# EAGLE design PushButtonAction_4017 (EAGLE 9.5.2)

## Sheet 1 of 2
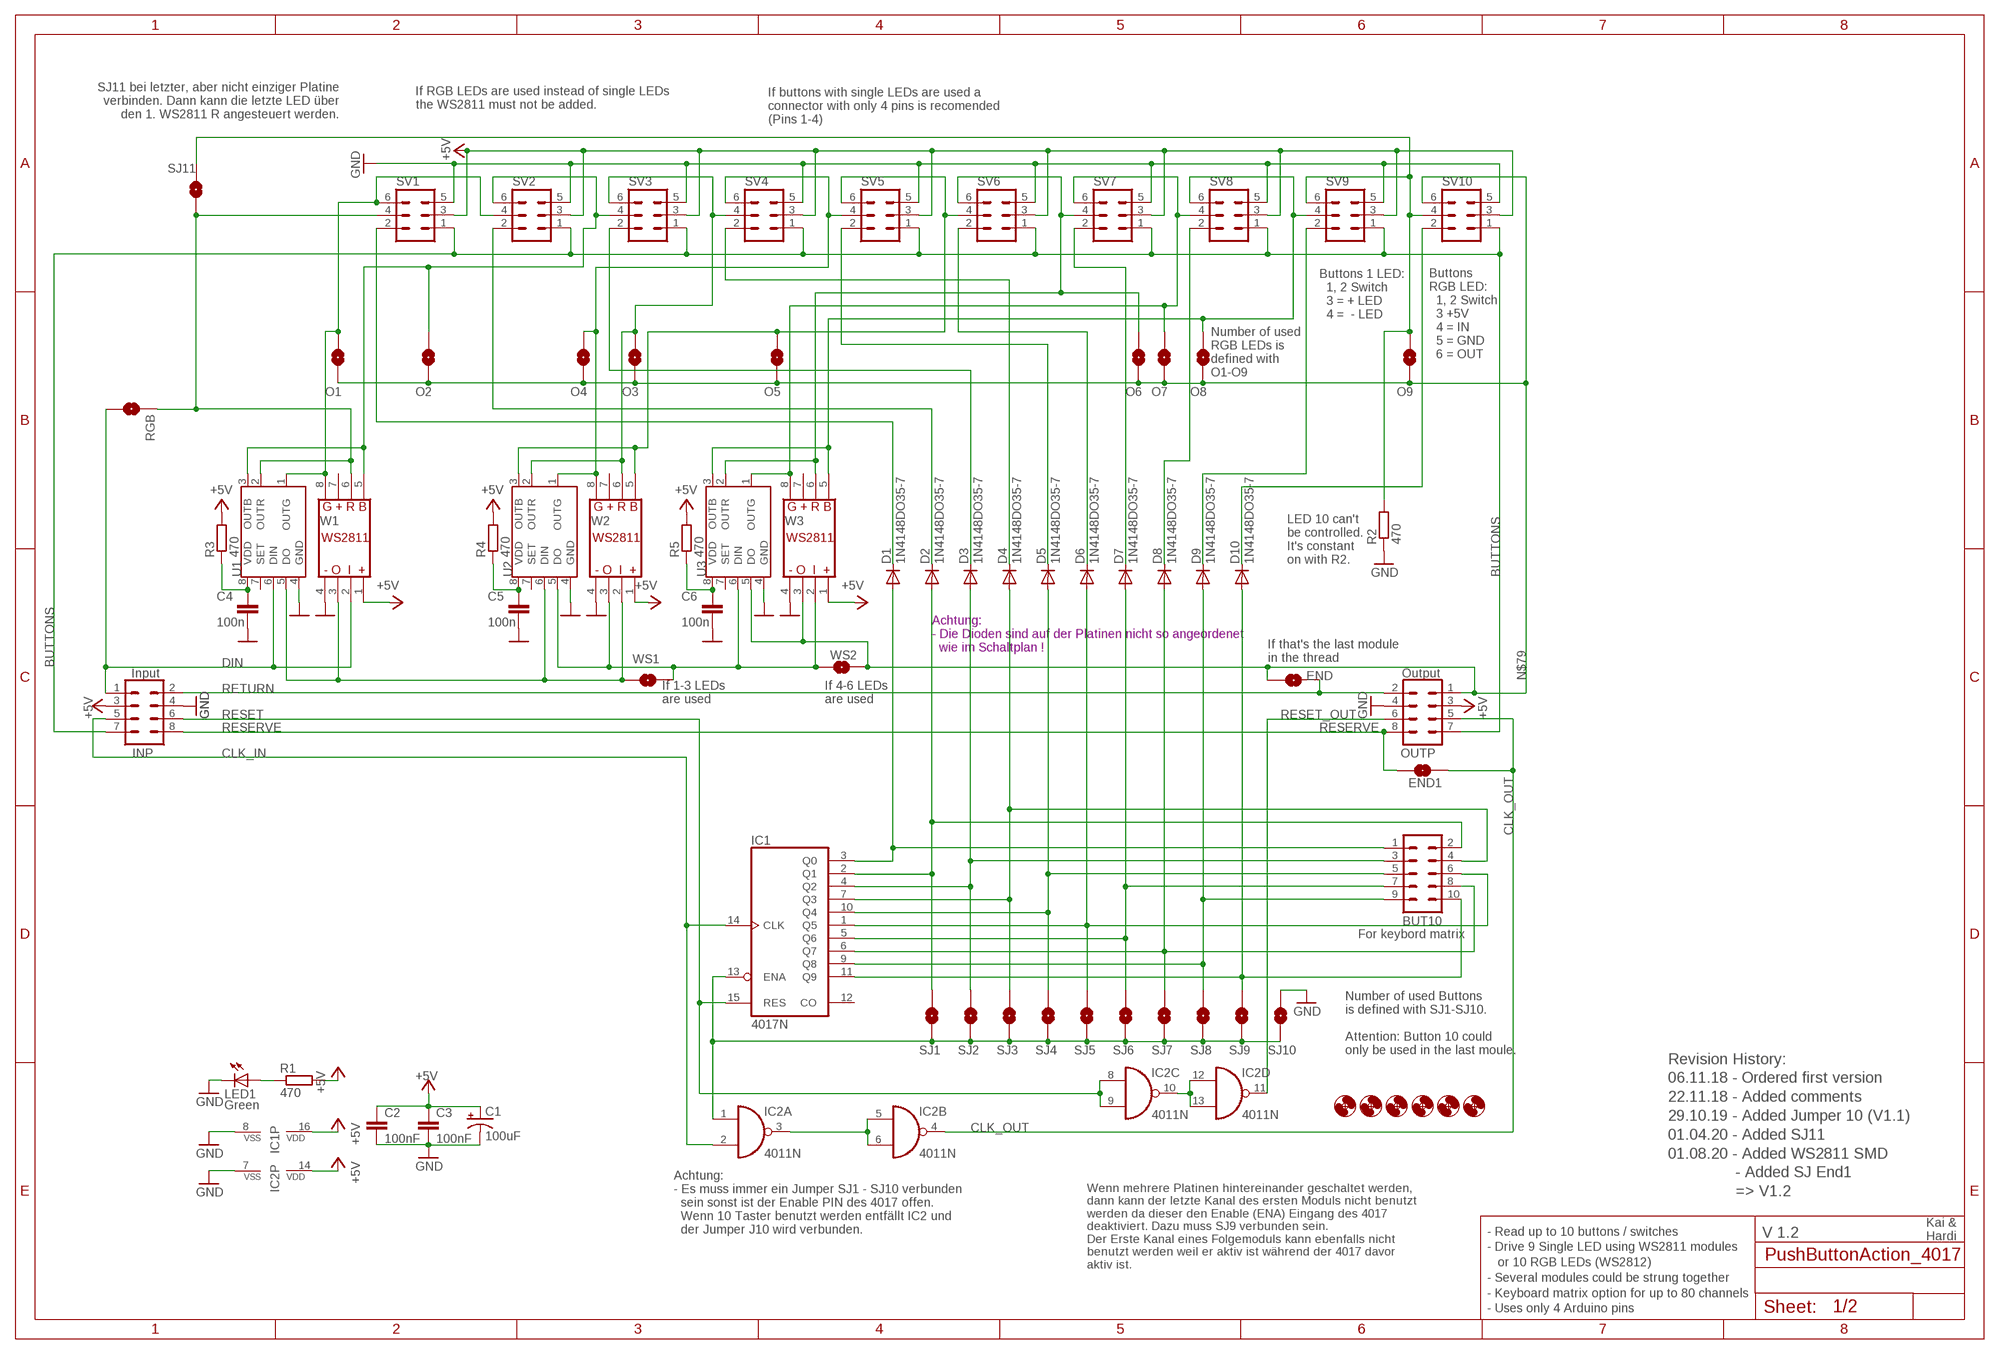
[diagram p0: schematic, sheet 1]

### Parts
BUT10  CON-HARTING-ML_ML10  [CON-HARTING-ML_ML10]
C1  100uF  100UF-25V-20%(PTH)  [CPOL-RADIAL-100UF-25V]
C2  100nF  0.1UF-50V-20%(PTH)KIT-EZ  [CAP-PTH-SMALL-KIT]
C3  100nF  0.1UF-50V-20%(PTH)KIT-EZ  [CAP-PTH-SMALL-KIT]
C4  100n  C-EU025-024X044  [C025-024X044]
C5  100n  C-EU025-024X044  [C025-024X044]
C6  100n  C-EU025-024X044  [C025-024X044]
D1  1N4148DO35-7  [DO35-7]
D2  1N4148DO35-7  [DO35-7]
D3  1N4148DO35-7  [DO35-7]
D4  1N4148DO35-7  [DO35-7]
D5  1N4148DO35-7  [DO35-7]
D6  1N4148DO35-7  [DO35-7]
D7  1N4148DO35-7  [DO35-7]
D8  1N4148DO35-7  [DO35-7]
D9  1N4148DO35-7  [DO35-7]
D10  1N4148DO35-7  [DO35-7]
END  SOLDERJUMPERNO  [SJ_2S-NO]
END1  SOLDERJUMPERNO  [SJ_2S-NO]
H1  MOUNT-HOLE3.0  [3,0]
H2  MOUNT-HOLE3.0  [3,0]
H3  MOUNT-HOLE3.0  [3,0]
H4  MOUNT-HOLE3.0  [3,0]
H5  MOUNT-HOLE3.0  [3,0]
H6  MOUNT-HOLE3.0  [3,0]
IC1  4017N  [DIL16]
IC2  4011N  [DIL14]
INP  CON-HARTING-ML_ML08  [CON-HARTING-ML_ML08]
LED1  Green  LED3MM  [LED3MM]
O1  SOLDERJUMPERNO  [SJ_2S-NO]
O2  SOLDERJUMPERNO  [SJ_2S-NO]
O3  SOLDERJUMPERNO  [SJ_2S-NO]
O4  SOLDERJUMPERNO  [SJ_2S-NO]
O5  SOLDERJUMPERNO  [SJ_2S-NO]
O6  SOLDERJUMPERNO  [SJ_2S-NO]
O7  SOLDERJUMPERNO  [SJ_2S-NO]
O8  SOLDERJUMPERNO  [SJ_2S-NO]
O9  SOLDERJUMPERNO  [SJ_2S-NO]
OUTP  CON-HARTING-ML_ML08  [CON-HARTING-ML_ML08]
R1  470  R-EU_0207/2V  [0207/2V]
R2  470  R-EU_0204/5  [0204/5]
R3  470  R-EU_0207/2V  [0207/2V]
R4  470  R-EU_0207/2V  [0207/2V]
R5  470  R-EU_0207/2V  [0207/2V]
RGB  SOLDERJUMPERNO  [SJ_2S-NO]
SJ1  SOLDERJUMPERNO  [SJ_2S-NO]
SJ2  SOLDERJUMPERNO  [SJ_2S-NO]
SJ3  SOLDERJUMPERNO  [SJ_2S-NO]
SJ4  SOLDERJUMPERNO  [SJ_2S-NO]
SJ5  SOLDERJUMPERNO  [SJ_2S-NO]
SJ6  SOLDERJUMPERNO  [SJ_2S-NO]
SJ7  SOLDERJUMPERNO  [SJ_2S-NO]
SJ8  SOLDERJUMPERNO  [SJ_2S-NO]
SJ9  SOLDERJUMPERNO  [SJ_2S-NO]
SJ10  SOLDERJUMPERNO  [SJ_2S-NO]
SJ11  SOLDERJUMPERNO  [SJ_2S-NO]
SV1  CON-HARTING-ML_ML6  [CON-HARTING-ML_ML6]
SV2  CON-HARTING-ML_ML6  [CON-HARTING-ML_ML6]
SV3  CON-HARTING-ML_ML6  [CON-HARTING-ML_ML6]
SV4  CON-HARTING-ML_ML6  [CON-HARTING-ML_ML6]
SV5  CON-HARTING-ML_ML6  [CON-HARTING-ML_ML6]
SV6  CON-HARTING-ML_ML6  [CON-HARTING-ML_ML6]
SV7  CON-HARTING-ML_ML6  [CON-HARTING-ML_ML6]
SV8  CON-HARTING-ML_ML6  [CON-HARTING-ML_ML6]
SV9  CON-HARTING-ML_ML6  [CON-HARTING-ML_ML6]
SV10  CON-HARTING-ML_ML6  [CON-HARTING-ML_ML6]
U1  S3PO_MODUL_WS2811_SOUND_MP3-TF-16P_WS2811_AND_ATTINY_WS2811-ICSOP8  [SOP8]
U2  S3PO_MODUL_WS2811_SOUND_MP3-TF-16P_WS2811_AND_ATTINY_WS2811-ICSOP8  [SOP8]
U3  S3PO_MODUL_WS2811_SOUND_MP3-TF-16P_WS2811_AND_ATTINY_WS2811-ICSOP8  [SOP8]
W1  WS28115V  [WS2811_WS2811_5V]
W2  WS28115V  [WS2811_WS2811_5V]
W3  WS28115V  [WS2811_WS2811_5V]
WS1  SOLDERJUMPERNO  [SJ_2S-NO]
WS2  SOLDERJUMPERNO  [SJ_2S-NO]

### Nets
+5V: C1.1(+) C2.1 C3.1 IC1.16(VDD) IC2.14(P:VDD) INP.3 OUTP.3 R1.2 R3.2 R4.2 R5.2 SV1.3 SV2.3 SV3.3 SV4.3 SV5.3 SV6.3 SV7.3 SV8.3 SV9.3 SV10.3 W1.1 W2.1 W3.1
BUTTONS: INP.7 OUTP.7 SV1.1 SV2.1 SV3.1 SV4.1 SV5.1 SV6.1 SV7.1 SV8.1 SV9.1 SV10.1
CLK_IN: IC1.14(CLK) IC2.2(A:I1) INP.5
CLK_OUT: END1.1 IC2.4(B:O) OUTP.5
DIN: INP.1 RGB.1 U1.6(DIN) W1.2
GND: C1.2(-) C2.2 C3.2 C4.2 C5.2 C6.2 IC1.8(VSS) IC2.7(P:VSS) INP.4 LED1.K(C) OUTP.4 R2.1 SJ10.2 SV1.5 SV2.5 SV3.5 SV4.5 SV5.5 SV6.5 SV7.5 SV8.5 SV9.5 SV10.5 U1.4(GND) U2.4(GND) U3.4(GND) W1.4 W2.4 W3.4
N$1: IC2.3(A:O) IC2.5(B:I0) IC2.6(B:I1)
N$2: IC1.13(ENA) IC2.1(A:I0) SJ1.1 SJ2.1 SJ3.1 SJ4.1 SJ5.1 SJ6.1 SJ7.1 SJ8.1 SJ9.1 SJ10.1
N$3: IC2.10(C:O) IC2.12(D:I0) IC2.13(D:I1)
N$4: RGB.2 SJ11.2 SV1.4 U1.2(OUTR) W1.6
N$5: BUT10.10 D10.A IC1.11(Q9) SJ9.2
N$6: D1.C SV1.2
N$7: U1.5(DO) U2.6(DIN) W1.3 W2.2 WS1.1
N$8: O5.2 SV5.6 SV6.4 U2.3(OUTB) W2.5
N$9: D2.C SV2.2
N$10: D3.C SV3.2
N$11: BUT10.2 D2.A IC1.2(Q1) SJ1.2
N$12: BUT10.3 D3.A IC1.4(Q2) SJ2.2
N$13: BUT10.4 D4.A IC1.7(Q3) SJ3.2
N$14: BUT10.5 D5.A IC1.10(Q4) SJ4.2
N$15: BUT10.6 D6.A IC1.1(Q5) SJ5.2
N$16: BUT10.7 D7.A IC1.5(Q6) SJ6.2
N$17: BUT10.8 D8.A IC1.6(Q7) SJ7.2
N$18: BUT10.9 D9.A IC1.9(Q8) SJ8.2
N$19: D4.C SV4.2
N$20: D5.C SV5.2
N$21: LED1.A R1.1
N$22: U2.5(DO) U3.6(DIN) W2.3 W3.2 WS1.2 WS2.2
N$23: D6.C SV6.2
N$25: D8.C SV8.2
N$26: D9.C SV9.2
N$27: D10.C SV10.2
N$35: BUT10.1 D1.A IC1.3(Q0)
N$45: O1.2 SV1.6 SV2.4 U1.1(OUTG) W1.8
N$46: O2.2 SV2.6 SV3.4 U1.3(OUTB) W1.5
N$49: O4.2 SV4.6 SV5.4 U2.1(OUTG) W2.8
N$51: O3.2 SV3.6 SV4.4 U2.2(OUTR) W2.6
N$54: O6.2 SV6.6 SV7.4 U3.2(OUTR) W3.6
N$56: O7.2 SV7.6 SV8.4 U3.1(OUTG) W3.8
N$57: O8.2 SV8.6 SV9.4 U3.3(OUTB) W3.5
N$58: O9.2 R2.2 SJ11.1 SV9.6 SV10.4
N$76: C4.1 R3.1 U1.8(VDD)
N$77: C5.1 R4.1 U2.8(VDD)
N$78: C6.1 R5.1 U3.8(VDD)
N$79: END.2 O1.1 O2.1 O3.1 O4.1 O5.1 O6.1 O7.1 O8.1 O9.1 OUTP.1 SV10.6 U3.5(DO) W3.3 WS2.1
O6: D7.C SV7.2
RESERVE: END1.2 INP.8 OUTP.8
RESET: IC1.15(RES) IC2.8(C:I0) IC2.9(C:I1) INP.6
RESET_OUT: IC2.11(D:O) OUTP.6
RETURN: END.1 INP.2 OUTP.2
Unconnected: IC1.12(CO) U1.7(SET) U2.7(SET) U3.7(SET) W1.7 W2.7 W3.7

### Notes on the sheet
- SJ11 bei letzter, aber nicht einziger Platine
  verbinden. Dann kann die letzte LED über
  den 1. WS2811 R angesteuert werden.
- If RGB LEDs are used instead of single LEDs
  the WS2811 must not be added.
- If buttons with single LEDs are used a 
  connector with only 4 pins is recomended
  (Pins 1-4)
- Buttons 1 LED:
    1, 2 Switch
    3 = + LED
    4 =  - LED
- Buttons
  RGB LED:
    1, 2 Switch
    3 +5V
    4 = IN
    5 = GND
    6 = OUT
- Number of used
  RGB LEDs is 
  defined with 
  O1-O9
- LED 10 can't
  be controlled.
  It's constant
  on with R2.
- Achtung:
  - Die Dioden sind auf der Platinen nicht so angeordenet
    wie im Schaltplan !
- If that's the last module 
  in the thread
- Input | Output
- If 1-3 LEDs
  are used
- If 4-6 LEDs
  are used
- For keybord matrix
- Number of used Buttons
  is defined with SJ1-SJ10.
  
  Attention: Button 10 could
  only be used in the last moule.
- Achtung:
  - Es muss immer ein Jumper SJ1 - SJ10 verbunden
    sein sonst ist der Enable PIN des 4017 offen.
    Wenn 10 Taster benutzt werden entfällt IC2 und 
    der Jumper J10 wird verbunden.
- Wenn mehrere Platinen hintereinander geschaltet werden,
  dann kann der letzte Kanal des ersten Moduls nicht benutzt
  werden da dieser den Enable (ENA) Eingang des 4017
  deaktiviert. Dazu muss SJ9 verbunden sein.
  Der Erste Kanal eines Folgemoduls kann ebenfalls nicht
  benutzt werden weil er aktiv ist während der 4017 davor
  aktiv ist.
- Revision History:
  06.11.18 - Ordered first version
  22.11.18 - Added comments
  29.10.19 - Added Jumper 10 (V1.1)
  01.04.20 - Added SJ11
  01.08.20 - Added WS2811 SMD
                 - Added SJ End1
                 => V1.2
- V 1.2
- Kai & 
  Hardi
- - Read up to 10 buttons / switches
  - Drive 9 Single LED using WS2811 modules
     or 10 RGB LEDs (WS2812)
  - Several modules could be strung together
  - Keyboard matrix option for up to 80 channels
  - Uses only 4 Arduino pins

## Sheet 2 of 2
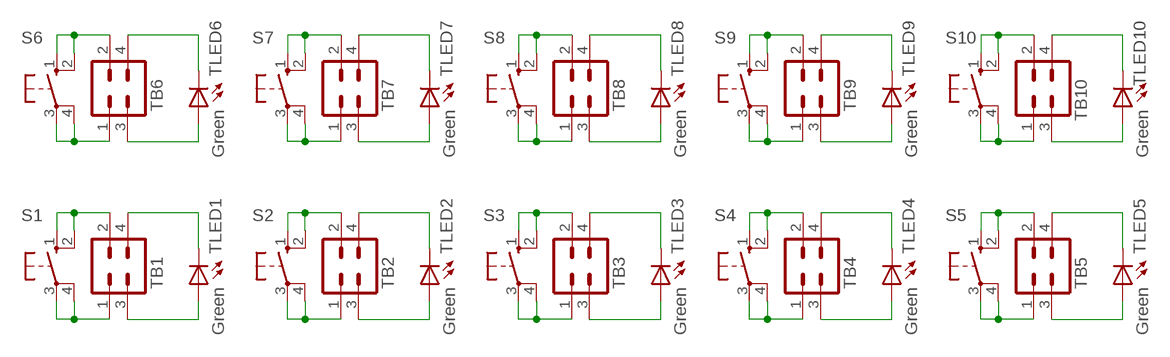
[diagram p1: schematic, sheet 2]

### Parts
S1  10-XX  [B3F-10XX]
S2  10-XX  [B3F-10XX]
S3  10-XX  [B3F-10XX]
S4  10-XX  [B3F-10XX]
S5  10-XX  [B3F-10XX]
S6  10-XX  [B3F-10XX]
S7  10-XX  [B3F-10XX]
S8  10-XX  [B3F-10XX]
S9  10-XX  [B3F-10XX]
S10  10-XX  [B3F-10XX]
TB1  CON-HARTING-ML_ML4ML4_FEMALE  [ML_ML4_FEMALE]
TB2  CON-HARTING-ML_ML4ML4_FEMALE  [ML_ML4_FEMALE]
TB3  CON-HARTING-ML_ML4ML4_FEMALE  [ML_ML4_FEMALE]
TB4  CON-HARTING-ML_ML4ML4_FEMALE  [ML_ML4_FEMALE]
TB5  CON-HARTING-ML_ML4ML4_FEMALE  [ML_ML4_FEMALE]
TB6  CON-HARTING-ML_ML4ML4_FEMALE  [ML_ML4_FEMALE]
TB7  CON-HARTING-ML_ML4ML4_FEMALE  [ML_ML4_FEMALE]
TB8  CON-HARTING-ML_ML4ML4_FEMALE  [ML_ML4_FEMALE]
TB9  CON-HARTING-ML_ML4ML4_FEMALE  [ML_ML4_FEMALE]
TB10  CON-HARTING-ML_ML4ML4_FEMALE  [ML_ML4_FEMALE]
TLED1  Green  LED_LED3MM  [LED_LED3MM]
TLED2  Green  LED_LED3MM  [LED_LED3MM]
TLED3  Green  LED_LED3MM  [LED_LED3MM]
TLED4  Green  LED_LED3MM  [LED_LED3MM]
TLED5  Green  LED_LED3MM  [LED_LED3MM]
TLED6  Green  LED_LED3MM  [LED_LED3MM]
TLED7  Green  LED_LED3MM  [LED_LED3MM]
TLED8  Green  LED_LED3MM  [LED_LED3MM]
TLED9  Green  LED_LED3MM  [LED_LED3MM]
TLED10  Green  LED_LED3MM  [LED_LED3MM]

### Nets
N$24: S1.1(S) S1.2(S1) TB1.2
N$28: S1.3(P) S1.4(P1) TB1.1
N$29: TB1.3 TLED1.A
N$30: TB1.4 TLED1.K(C)
N$31: S2.1(S) S2.2(S1) TB2.2
N$32: S2.3(P) S2.4(P1) TB2.1
N$33: TB2.3 TLED2.A
N$34: TB2.4 TLED2.K(C)
N$36: S3.1(S) S3.2(S1) TB3.2
N$37: S3.3(P) S3.4(P1) TB3.1
N$38: TB3.3 TLED3.A
N$39: TB3.4 TLED3.K(C)
N$40: S4.1(S) S4.2(S1) TB4.2
N$41: S4.3(P) S4.4(P1) TB4.1
N$42: TB4.3 TLED4.A
N$43: TB4.4 TLED4.K(C)
N$44: S5.1(S) S5.2(S1) TB5.2
N$47: S5.3(P) S5.4(P1) TB5.1
N$48: TB5.3 TLED5.A
N$50: TB5.4 TLED5.K(C)
N$52: S6.1(S) S6.2(S1) TB6.2
N$53: S6.3(P) S6.4(P1) TB6.1
N$55: TB6.3 TLED6.A
N$59: TB6.4 TLED6.K(C)
N$60: S7.1(S) S7.2(S1) TB7.2
N$61: S7.3(P) S7.4(P1) TB7.1
N$62: TB7.3 TLED7.A
N$63: TB7.4 TLED7.K(C)
N$64: S8.1(S) S8.2(S1) TB8.2
N$65: S8.3(P) S8.4(P1) TB8.1
N$66: TB8.3 TLED8.A
N$67: TB8.4 TLED8.K(C)
N$68: S9.1(S) S9.2(S1) TB9.2
N$69: S9.3(P) S9.4(P1) TB9.1
N$70: TB9.3 TLED9.A
N$71: TB9.4 TLED9.K(C)
N$72: S10.1(S) S10.2(S1) TB10.2
N$73: S10.3(P) S10.4(P1) TB10.1
N$74: TB10.3 TLED10.A
N$75: TB10.4 TLED10.K(C)

## Library data of the parts
BUT10 = PushButtonAction_4017_2:CON-HARTING-ML_ML10: HARTING; OC_FARNELL: unknown; OC_NEWARK: unknown
C1 = SparkFun-Capacitors:100UF-25V-20%(PTH): CAP-08439; PROD_ID: CAP-08439
C2 C3 = SparkFun-Capacitors:0.1UF-50V-20%(PTH): CAP-08370; PROD_ID: CAP-08370
C4-C6 = rcl:C-EU: CAPACITOR, European symbol; SPICEPREFIX: C
D1-D10 = diode:1N4148: DIODE high speed (Philips)
END END1 O1-O9 RGB SJ1-SJ11 WS1 WS2 = SparkFun-Retired:SOLDERJUMPER: Solder Jumper Standard SMD solder jumper. Used to automate production. Two varients : Normally Open and Normally Closed are the same, but have different paste layers. NC will have a large amount of paste and should jumper during reflow.
H1-H6 = holes:MOUNT-HOLE: MOUNTING HOLE with drill center marker
IC1 = 40xx:4017: COUNTER/DIVIDER
IC2 = 40xx:4011: Quad 2-input NAND; SPICEPREFIX: J
INP OUTP = PushButtonAction_4017_2:CON-HARTING-ML_ML08: Modified by Hardi; OC_FARNELL: unknown; OC_NEWARK: unknown
LED1 = led:LED: LED OSRAM: - CHIPLED LG R971, LG N971, LY N971, LG Q971, LY Q971, LO R971, LY R971 LH N974, LH R974 LS Q976, LO Q976, LY Q976 LO Q996 - Hyper CHIPLED LW Q18S LB Q993, LB Q99A, LB R99A - SideLED LS A670, LO A670, LY A670, LG A670, LP A670 LB A673, LV A673, LT A673, LW A673 LH A674 LY A675 LS A676, LA A676, LO A676, LY A676, LW A676 LS A679, LY A679, LG A679 - Hyper Micro SIDELED® LS Y876, LA Y876, LO Y876, LY Y876 LT Y87S - SmartLED LW L88C, LW L88S LB L89C, LB L89S, LG L890 LS L89K, LO L89K, LY L89K LS L896, LA L896, LO L896, LY L896 - TOPLED LS T670, LO T670, LY T670, LG T670, LP T670 LSG T670, LSP T670, LSY T670, LOP T670, LYG T670 LG T671, LOG T671, LSG T671 LB T673, LV T673, LT T673, LW T673 LH T674 LS T676, LA T676, LO T676, LY T676, LB T676, LH T676, LSB T676, LW T676 LB T67C, LV T67C, LT T67C, LS T67K, LO T67K, LY T67K, LW E67C LS E67B, LA E67B, LO E67B, LY E67B, LB E67C, LV E67C, LT E67C LW T67C LS T679, LY T679, LG T679 LS T770, LO T770, LY T770, LG T770, LP T770 LB T773, LV T773, LT T773, LW T773 LH T774 LS E675, LA E675, LY E675, LS T675 LS T776, LA T776, LO T776, LY T776, LB T776 LHGB T686 LT T68C, LB T68C - Hyper Mini TOPLED® LB M676 - Mini TOPLED Santana® LG M470 LS M47K, LO M47K, LY M47K Source: http://www.osram.convergy.de LUXEON: - LUMILED® LXK2-PW12-R00, LXK2-PW12-S00, LXK2-PW14-U00, LXK2-PW14-V00 LXK2-PM12-R00, LXK2-PM12-S00, LXK2-PM14-U00 LXK2-PE12-Q00, LXK2-PE12-R00, LXK2-PE12-S00, LXK2-PE14-T00, LXK2-PE14-U00 LXK2-PB12-K00, LXK2-PB12-L00, LXK2-PB12-M00, LXK2-PB14-N00, LXK2-PB14-P00, LXK2-PB14-Q00 LXK2-PR12-L00, LXK2-PR12-M00, LXK2-PR14-Q00, LXK2-PR14-R00 LXK2-PD12-Q00, LXK2-PD12-R00, LXK2-PD12-S00 LXK2-PH12-R00, LXK2-PH12-S00 LXK2-PL12-P00, LXK2-PL12-Q00, LXK2-PL12-R00 Source: www.luxeon.com KINGBRIGHT: KA-3528ASYC Source: www.kingbright.com
R1-R5 = rcl:R-EU_: RESISTOR, European symbol; SPICEPREFIX: R
S1-S10 = switch-omron:10-XX: OMRON SWITCH; MPN: B3F-1000; OC_FARNELL: 176432; OC_NEWARK: 36M3542
SV1-SV10 = PushButtonAction_4017_4:CON-HARTING-ML_ML6: HARTING; OC_FARNELL: unknown; OC_NEWARK: unknown
TB1-TB10 = RGB-LED-Verteiler:CON-HARTING-ML_ML4
TLED1-TLED10 = Sound_MP3-TF-16P_and_WS2811:LED_LED: LED OSRAM: - CHIPLED LG R971, LG N971, LY N971, LG Q971, LY Q971, LO R971, LY R971 LH N974, LH R974 LS Q976, LO Q976, LY Q976 LO Q996 - Hyper CHIPLED LW Q18S LB Q993, LB Q99A, LB R99A - SideLED LS A670, LO A670, LY A670, LG A670, LP A670 LB A673, LV A673, LT A673, LW A673 LH A674 LY A675 LS A676, LA A676, LO A676, LY A676, LW A676 LS A679, LY A679, LG A679 - Hyper Micro SIDELED® LS Y876, LA Y876, LO Y876, LY Y876 LT Y87S - SmartLED LW L88C, LW L88S LB L89C, LB L89S, LG L890 LS L89K, LO L89K, LY L89K LS L896, LA L896, LO L896, LY L896 - TOPLED LS T670, LO T670, LY T670, LG T670, LP T670 LSG T670, LSP T670, LSY T670, LOP T670, LYG T670 LG T671, LOG T671, LSG T671 LB T673, LV T673, LT T673, LW T673 LH T674 LS T676, LA T676, LO T676, LY T676, LB T676, LH T676, LSB T676, LW T676 LB T67C, LV T67C, LT T67C, LS T67K, LO T67K, LY T67K, LW E67C LS E67B, LA E67B, LO E67B, LY E67B, LB E67C, LV E67C, LT E67C LW T67C LS T679, LY T679, LG T679 LS T770, LO T770, LY T770, LG T770, LP T770 LB T773, LV T773, LT T773, LW T773 LH T774 LS E675, LA E675, LY E675, LS T675 LS T776, LA T776, LO T776, LY T776, LB T776 LHGB T686 LT T68C, LB T68C - Hyper Mini TOPLED® LB M676 - Mini TOPLED Santana® LG M470 LS M47K, LO M47K, LY M47K Source: http://www.osram.convergy.de LUXEON: - LUMILED® LXK2-PW12-R00, LXK2-PW12-S00, LXK2-PW14-U00, LXK2-PW14-V00 LXK2-PM12-R00, LXK2-PM12-S00, LXK2-PM14-U00 LXK2-PE12-Q00, LXK2-PE12-R00, LXK2-PE12-S00, LXK2-PE14-T00, LXK2-PE14-U00 LXK2-PB12-K00, LXK2-PB12-L00, LXK2-PB12-M00, LXK2-PB14-N00, LXK2-PB14-P00, LXK2-PB14-Q00 LXK2-PR12-L00, LXK2-PR12-M00, LXK2-PR14-Q00, LXK2-PR14-R00 LXK2-PD12-Q00, LXK2-PD12-R00, LXK2-PD12-S00 LXK2-PH12-R00, LXK2-PH12-S00 LXK2-PL12-P00, LXK2-PL12-Q00, LXK2-PL12-R00 Source: www.luxeon.com KINGBRIGHT: KA-3528ASYC Source: www.kingbright.com
U1-U3 = S3PO_Modul_WS2811:S3PO_MODUL_WS2811_SOUND_MP3-TF-16P_WS2811_AND_ATTINY_WS2811-IC: Die Pin Nummern für R und G sind getauscht damit sie gleich angesteuert werden wie die WS2812. Der Daten Strom der WS2811 ist RGB, Beim WS2812 ist es aber GRB.
W1-W3 = PushButtonAction_4017_2:WS2811: Modified by Hardi

## Board
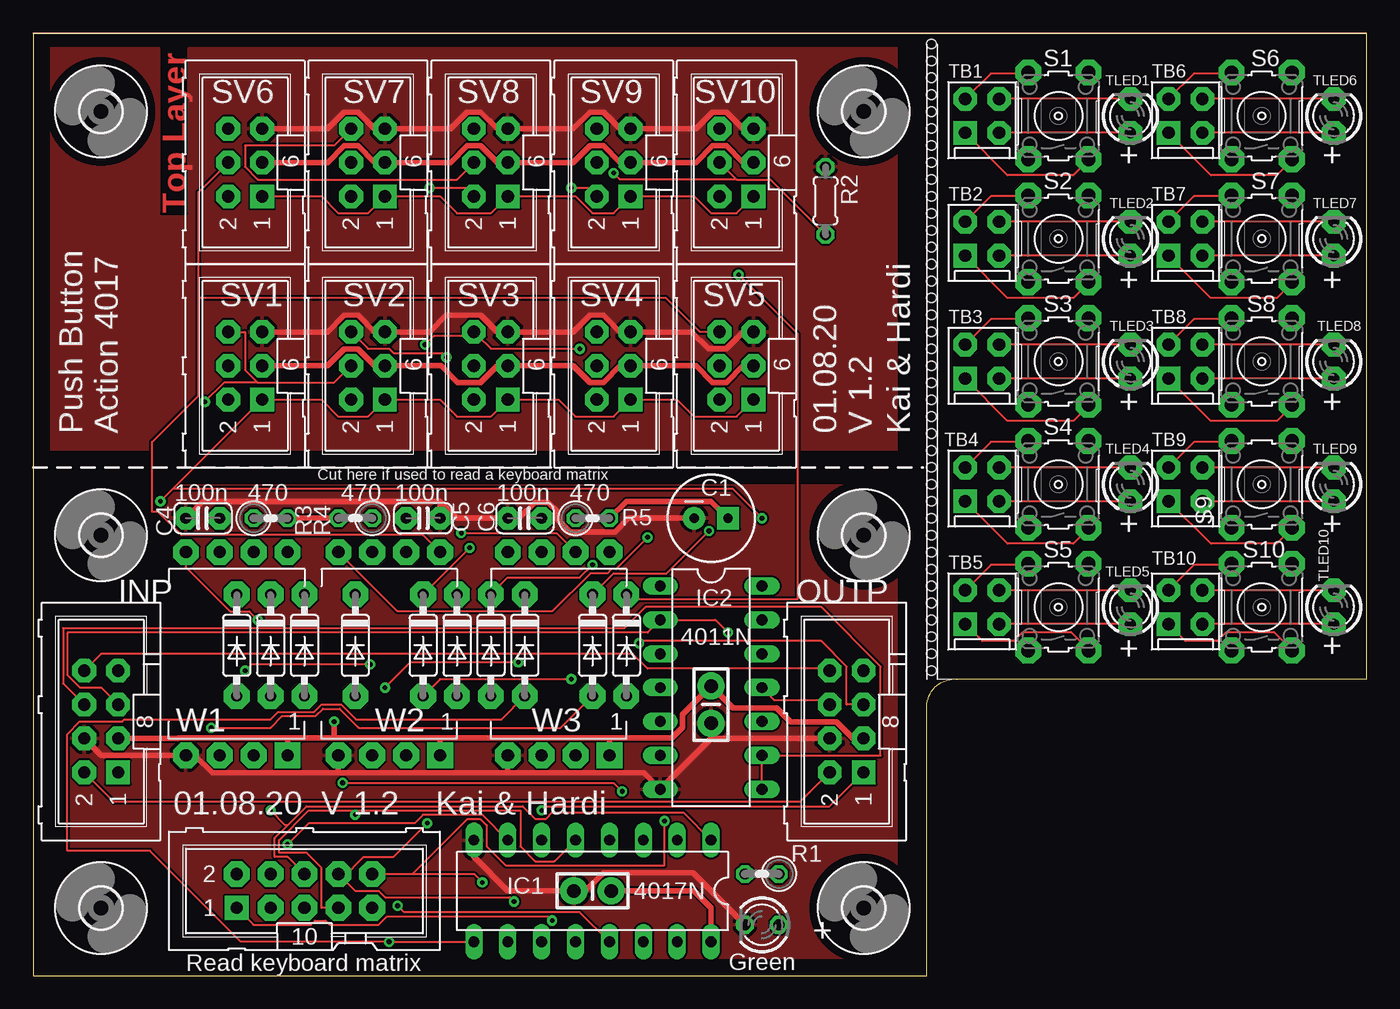
[diagram p2: board, top side]
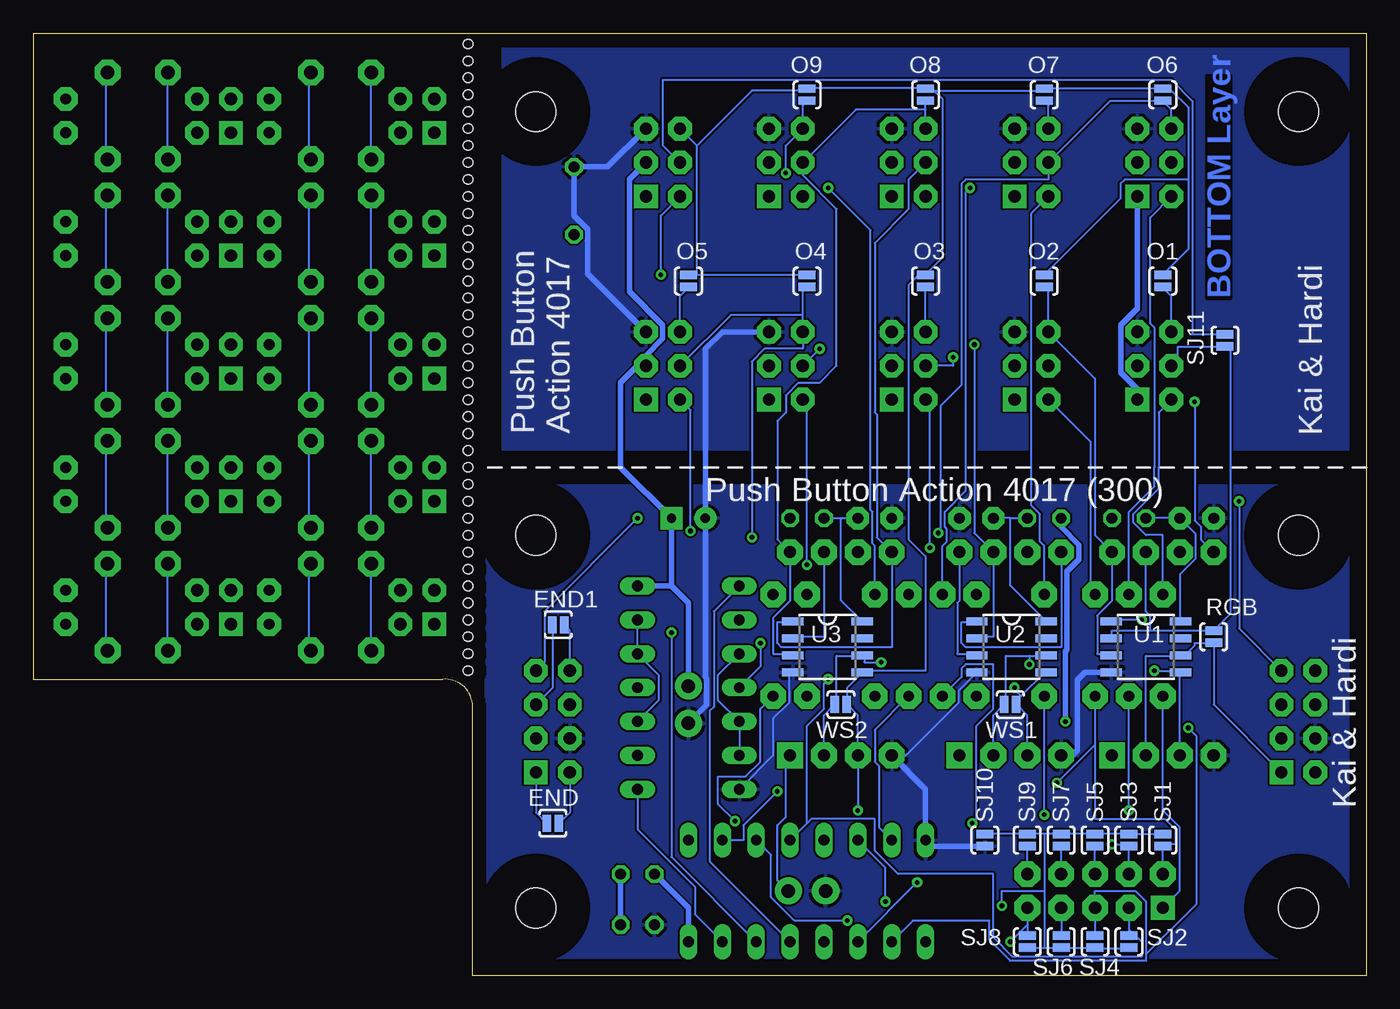
[diagram p3: board, bottom side, seen from below]

Size 99.9 x 70.64 mm. Coordinates in mm from the lower left corner, seen from the top.
Outline: 0,0 66.98,0 66.98,20 arc-99 69.22,22.23 99.9,22.23 99.9,70.64 0,70.64 0,0
Copper layers (1*16): Top 0.035mm / dielectric 1.5mm / Bottom 0.035mm
Design rules "default *": minimum track width 6mil, minimum drill 0.35mm, track to track 6mil, track to pad 6mil, pad to pad 6mil, via to via 6mil, smd to smd 6mil, copper to edge 40mil, drill to drill 6mil, minimum pad ring 10mil, minimum via ring 8mil, stop-mask expansion 4mil, vias tented up to drill 0mil, thermal gap 10mil
Holes 0.7 mm at 67.31,22.86 67.31,24.13 67.31,25.4 67.31,26.67 67.31,27.94 67.31,29.21 67.31,30.48 67.31,31.75 67.31,33.02 67.31,34.29 67.31,35.56 67.31,36.83 67.31,38.1 67.31,39.37 67.31,40.64 67.31,41.91 67.31,43.18 67.31,44.45 67.31,45.72 67.31,46.99 67.31,48.26 67.31,49.53 67.31,50.8 67.31,52.07 67.31,53.34 67.31,54.61 67.31,55.88 67.31,57.15 67.31,58.42 67.31,59.69 67.31,60.96 67.31,62.23 67.31,63.5 67.31,64.77 67.31,66.04 67.31,67.31 67.31,68.58 67.31,69.85

### Footprints (pad centres in the part's own frame; a part is rotated, then mirrored left to right if it is on the bottom)
CON-HARTING-ML_ML10 = drill 0.914 pad 1.778 square: 1 -5.08,-1.27 | drill 0.914 pad 1.93 octagon: 2 -5.08,1.27; 3 -2.54,-1.27; 4 -2.54,1.27; 5 0,-1.27; 6 0,1.27; 7 2.54,-1.27; 8 2.54,1.27; 9 5.08,-1.27; 10 5.08,1.27
CPOL-RADIAL-100UF-25V = drill 0.7 pad 1.651 square: 1 1.27,0 | drill 0.7 pad 1.651: 2 -1.27,0
CAP-PTH-SMALL-KIT = drill 1.016 pad 2.032: 1 -1.397,0; 2 1.397,0
C025-024X044 = drill 0.813 pad 1.676 octagon: 1 -1.27,0; 2 1.27,0
DO35-7 = drill 0.813 pad 1.93 octagon: A 3.81,0; C -3.81,0
SJ_2S-NO = smd 0.635 x 1.27: 1 -0.45,0; 2 0.45,0
3,0 = hole 3: 0,0
DIL16 = drill 0.813 long: 1 -8.89,-3.81; 2 -6.35,-3.81; 3 -3.81,-3.81; 4 -1.27,-3.81; 5 1.27,-3.81; 6 3.81,-3.81; 7 6.35,-3.81; 8 8.89,-3.81; 9 8.89,3.81; 10 6.35,3.81; 11 3.81,3.81; 12 1.27,3.81; 13 -1.27,3.81; 14 -3.81,3.81; 15 -6.35,3.81; 16 -8.89,3.81
DIL14 = drill 0.813 long: 1 -7.62,-3.81; 2 -5.08,-3.81; 3 -2.54,-3.81; 4 0,-3.81; 5 2.54,-3.81; 6 5.08,-3.81; 7 7.62,-3.81; 8 7.62,3.81; 9 5.08,3.81; 10 2.54,3.81; 11 0,3.81; 12 -2.54,3.81; 13 -5.08,3.81; 14 -7.62,3.81
CON-HARTING-ML_ML08 = drill 0.914 pad 1.778 square: 1 -5.08,-1.27 | drill 0.914 pad 1.778 octagon: 2 -5.08,1.27; 3 -2.54,-1.27; 4 -2.54,1.27; 5 0,-1.27; 6 0,1.27; 7 2.54,-1.27; 8 2.54,1.27
LED3MM = drill 0.813 octagon: A -1.27,0; K 1.27,0
0207/2V = drill 0.813 octagon: 1 -1.27,0; 2 1.27,0
0204/5 = drill 0.813 octagon: 1 -2.54,0; 2 2.54,0
B3F-10XX = drill 1.016 pad 1.93 octagon: 1 -3.251,2.261; 2 3.251,2.261; 3 -3.251,-2.261; 4 3.251,-2.261
CON-HARTING-ML_ML6 = drill 0.914 pad 1.778 square: 1 -2.54,-1.27 | drill 0.914 pad 1.778 octagon: 2 -2.54,1.27; 3 0,-1.27; 4 0,1.27; 5 2.54,-1.27; 6 2.54,1.27
ML_ML4_FEMALE = drill 0.914 pad 1.778 square: 1 -2.54,-1.27 | drill 0.914 pad 1.778 octagon: 2 -2.54,1.27; 3 0,-1.27; 4 0,1.27
LED_LED3MM = drill 0.813 pad 1.778 octagon: A -1.27,0; K 1.27,0
SOP8 = smd 0.6 x 1.6: 1 -1.905,-2.6; 2 -0.635,-2.6; 3 0.635,-2.6; 4 1.905,-2.6; 5 1.905,2.6; 6 0.635,2.6; 7 -0.635,2.6; 8 -1.905,2.6
WS2811_WS2811_5V = drill 0.914 pad 1.93 square: 1 2.54,-5.08 | drill 0.914 pad 1.93 octagon: 2 0,-5.08; 3 -2.54,-5.08; 4 -5.08,-5.08; 5 2.54,10.16; 6 0,10.16; 7 -2.54,10.16; 8 -5.08,10.16

### Placement (x,y rotation side)
BUT10  20.32,6.35 0 top
C1  50.8,34.29 0 top
C2  50.8,20.32 270 top
C3  41.91,6.35 180 top
C4  12.7,34.29 180 top
C5  29.21,34.29 0 top
C6  36.83,34.29 180 top
D1  15.24,24.77 270 top
D2  20.32,24.77 270 top
D3  29.21,24.77 270 top
D4  34.29,24.77 270 top
D5  41.91,24.77 270 top
D6  17.78,24.77 270 top
D7  24.13,24.77 270 top
D8  31.75,24.77 270 top
D9  36.83,24.77 270 top
D10  44.45,24.77 270 top
END  60.96,11.43 180 bottom
END1  60.55,26.3 0 bottom
H1  62.23,5.08 90 top
H2  5.08,5.08 90 top
H3  5.08,64.77 90 top
H4  62.23,64.77 90 top
H5  5.08,33.02 90 top
H6  62.23,33.02 90 top
IC1  41.91,6.35 180 top
IC2  50.8,21.59 270 top
INP  5.08,20.32 90 top
LED1  54.61,3.81 180 top
O1  15.24,52.07 270 bottom
O2  24.13,52.07 270 bottom
O3  33.02,52.07 270 bottom
O4  41.91,52.07 270 bottom
O5  50.8,52.07 270 bottom
O6  15.24,66.04 270 bottom
O7  24.13,66.04 270 bottom
O8  33.02,66.04 270 bottom
O9  41.91,66.04 270 bottom
OUTP  60.96,20.32 90 top
R1  54.61,7.62 180 top
R2  59.37,58.09 270 top
R3  17.78,34.29 0 top
R4  24.13,34.29 180 top
R5  41.91,34.29 0 top
RGB  11.43,25.4 90 bottom
S1  76.83,64.45 90 top
S2  76.83,55.24 90 top
S3  76.83,46.04 90 top
S4  76.83,36.83 90 top
S5  76.83,27.62 90 top
S6  92.08,64.45 90 top
S7  92.08,55.24 90 top
S8  92.08,46.04 90 top
S9  92.08,36.83 90 top
S10  92.08,27.62 90 top
SJ1  15.24,10.16 270 bottom
SJ2  17.78,2.54 90 bottom
SJ3  17.78,10.16 270 bottom
SJ4  20.32,2.54 90 bottom
SJ5  20.32,10.16 270 bottom
SJ6  22.86,2.54 90 bottom
SJ7  22.86,10.16 270 bottom
SJ8  25.4,2.54 90 bottom
SJ9  25.4,10.16 270 bottom
SJ10  28.57,10.16 270 bottom
SJ11  10.59,47.62 270 bottom
SV1  15.88,45.72 90 top
SV2  25.08,45.72 90 top
SV3  34.29,45.72 90 top
SV4  43.5,45.72 90 top
SV5  52.7,45.72 90 top
SV6  15.88,60.96 90 top
SV7  25.08,60.96 90 top
SV8  34.29,60.96 90 top
SV9  43.5,60.96 90 top
SV10  52.7,60.96 90 top
TB1  72.39,64.45 0 top
TB2  72.39,55.24 0 top
TB3  72.39,46.04 0 top
TB4  72.39,36.83 0 top
TB5  72.39,27.62 0 top
TB6  87.63,64.45 0 top
TB7  87.63,55.24 0 top
TB8  87.63,46.04 0 top
TB9  87.63,36.83 0 top
TB10  87.63,27.62 0 top
TLED1  82.23,64.45 90 top
TLED2  82.23,55.24 90 top
TLED3  82.23,46.04 90 top
TLED4  82.23,36.83 90 top
TLED5  82.23,27.62 90 top
TLED6  97.47,64.45 90 top
TLED7  97.47,55.24 90 top
TLED8  97.47,46.04 90 top
TLED9  97.47,36.83 90 top
TLED10  97.47,27.62 90 top
U1  16.51,24.64 270 bottom
U2  26.58,24.64 270 bottom
U3  40.37,24.64 270 bottom
W1  16.51,21.59 0 top
W2  27.94,21.59 0 top
W3  40.64,21.59 0 top
WS1  26.67,20.32 0 bottom
WS2  39.37,20.32 180 bottom

### Tracks (layer width: path | path; a pad name or v marks a point on that pad's centre or on a via)
+5V  (via drill 0.35)
  Top 0.406: C3.1 49.53,6.35 50.8,5.08 IC1.16 | OUTP.3 61.45,17.78 60.21,19.02 56.73,19.02 55.69,20.07 52.45,20.07 C2.1 48.67,19.58 48.67,18.63 47.87,17.83 43.18,17.83 | INP.3 10.83,17.78 10.88,17.83 19.05,17.83 | 19.05,17.83 22.54,17.83 | 22.54,17.83 30.48,17.83 | 30.48,17.83 43.18,17.83 | W1.1 19.05,17.83 | W2.1 30.48,17.83 | W3.1 43.18,17.83 | R5.2 44.45,35.56 50.8,35.56 C1.1 | v22.54,19.05 22.54,17.83 | SV5.3 53.2,45.72 51.95,44.48 50.92,44.48 49.67,45.72 SV4.3 43.99,45.72 42.74,44.48 41.71,44.48 40.47,45.72 SV3.3 34.78,45.72 33.54,44.48 31.8,44.48 30.55,45.72 SV2.3 25.57,45.72 24.33,46.97 23.3,46.97 22.05,45.72 SV1.3 | R4.2 R3.2 | SV10.3 53.2,60.96 51.95,62.2 50.92,62.2 49.67,60.96 SV9.3 43.99,60.96 42.74,62.2 41.71,62.2 40.47,60.96 SV8.3 34.78,60.96 33.54,62.2 32.5,62.2 31.26,60.96 SV7.3 25.57,60.96 24.33,62.2 23.3,62.2 22.05,60.96 SV6.3
  Bottom 0.152: W3.1 43.5,16.19 43.5,11.91 44.13,11.27 44.13,7.14 43.34,6.35 C3.1
  Bottom 0.406: IC1.16 50.8,5.08 R1.2 | C2.1 50.8,27.94 52.07,29.21 | 52.07,29.21 C1.1 55.88,38.1 55.88,44.45 54.61,45.72 SV5.3 53.98,46.5 52.73,47.74 52.73,48.78 55.22,51.27 55.22,59.72 SV10.3 | 52.07,29.21 IC2.14 | R4.2 22.86,33.62 21.54,32.3 21.54,31.2 22.43,30.31 22.43,24.43 22.54,24.31 v22.54,19.05
BUTTONS  (via drill 0.35)
  Top 0.152: SV5.1 52.7,41.91 49.53,41.91 48.26,43.18 SV4.1 43.5,41.91 40.64,41.91 39.37,43.18 SV3.1 34.29,41.91 31.75,41.91 30.48,43.18 SV2.1 25.08,41.91 22.86,41.91 21.59,43.18 SV1.1 10.48,36.51 | SV6.1 21.59,58.42 22.86,57.15 25.08,57.15 SV7.1 30.48,58.42 31.75,57.15 34.29,57.15 SV8.1 40.64,58.42 41.91,57.15 43.5,57.15 SV9.1 49.53,58.42 50.8,57.15 52.7,57.15 SV10.1 | 10.48,36.51 v9.53,35.56 | 10.48,36.51 52.39,36.51 v54.61,34.29
  Bottom 0.152: INP.7 9.53,26.04 v9.53,35.56 | OUTP.7 61.59,23.5 61.59,27.3 v54.61,34.29
  Bottom 0.406: SV1.1 17.14,43.96 18.39,45.2 18.39,48.78 17.14,50.02 SV6.1
CLK_IN  (via drill 0.35)
  Top 0.152: v52.07,25.72 51.12,26.67 IC2.2 46.04,25.72 2.54,25.72 2.54,22.54 3.49,21.59 5.08,21.59 INP.5
  Bottom 0.152: IC1.14 52.07,8.89 v52.07,25.72
CLK_OUT  (via drill 0.35)
  Top 0.152: v45.4,24.92 45.56,25.08 59.05,25.08 60.96,23.18 60.96,20.32 OUTP.5
  Bottom 0.152: OUTP.5 60.96,21.59 60.96,26.19 END1.1 | IC2.4 45.4,23.18 v45.4,24.92
DIN
  Bottom 0.152: 11.43,24.92 12.86,24.92 12.86,24.77 13.49,24.13 13.81,24.13 U1.6 13.97,23.97 16.51,23.97 W1.2 | INP.1 11.43,20.32 11.43,24.92 | 11.43,24.92 RGB.1
GND
  Top 0.406: INP.4 5.08,16.51 W1.4 12.1,16.51 13.42,15.19 22.86,15.19 | 22.86,15.19 35.56,15.19 | 35.56,15.19 45.77,15.19 IC2.7 50.8,17.78 | W3.4 35.56,15.19 | W2.4 22.86,15.19 | 50.8,17.78 C2.2 | 50.8,17.78 OUTP.4 | IC1.8 33.02,8.89 35.56,6.35 C3.2 41.37,6.35 42.74,7.72 49.43,7.72 LED1.K | SV1.5 22.05,48.26 23.3,49.51 24.33,49.51 25.57,48.26 SV2.5 29.71,48.26 30.95,49.51 33.54,49.51 34.78,48.26 SV3.5 40.47,48.26 41.71,49.51 42.74,49.51 43.99,48.26 SV4.5 49.35,48.26 50.59,47.02 51.95,47.02 53.2,48.26 SV5.5 | SV10.5 53.2,63.5 51.95,64.75 50.92,64.75 49.67,63.5 SV9.5 43.99,63.5 42.74,64.75 41.71,64.75 40.47,63.5 SV8.5 34.78,63.5 33.54,64.75 32.5,64.75 31.26,63.5 SV7.5 25.57,63.5 24.33,64.75 23.3,64.75 22.05,63.5 SV6.5 | C1.2 44.62,34.29 43.6,33.27 40.22,33.27 39.29,34.2 39.29,34.78 38.59,35.48 37.61,35.48 36.41,34.29 C6.2 31.75,34.29 30.48,35.56 | 30.48,35.56 12.7,35.56 C4.2 | C5.2 30.48,35.56
  Bottom 0.152: U3.4 43.26,22.45 43.26,20.46 44.45,19.27 44.45,16.51 IC2.7 | U2.4 30.56,21.36 30.56,20.46 34.51,16.51 W3.4
  Bottom 0.406: W3.4 33.02,13.97 IC1.8 32.57,9.71 SJ10.2 | U1.4 21.08,22.73 21.64,22.17 21.64,16.89 22.02,16.51 W2.4 | C2.2 49.43,20.3 49.43,22.29 49.53,22.39 C1.2 49.53,46.99 48.26,48.26 SV4.5 | SV5.5 58.36,52.64 58.36,55.97 59.37,56.99 R2.1 56.84,60.63 SV10.5
  pour Top: 1.27,36.83 64.77,36.83 64.77,1.27 1.27,1.27
  pour Top: 1.27,39.37 64.77,39.37 64.77,69.85 1.27,69.85
  pour Bottom: 1.27,69.85 64.77,69.85 64.77,39.37 1.27,39.37
  pour Bottom: 1.27,36.83 66.04,36.83 66.04,1.27 1.27,1.27
N$1
  Bottom 0.152: IC2.6 IC2.5 48.58,20.64 48.58,22.54 IC2.3
N$2  (via drill 0.35)
  Top 0.152: v27.3,5.24 27.78,4.76 40.96,4.76 IC1.13
  Bottom 0.152: 20.32,2.06 17.78,2.06 SJ2.1 | 20.32,2.06 22.86,2.06 | 20.32,2.06 SJ4.1 | 22.86,2.06 24.13,2.06 | 24.13,2.06 25.4,2.06 SJ8.1 | 22.86,2.06 SJ6.1 | 17.78,10.64 15.24,10.64 SJ1.1 | 17.78,10.64 20.32,10.64 | 17.78,10.64 SJ3.1 | 20.32,10.64 22.86,10.64 | 20.32,10.64 SJ5.1 | 22.86,10.64 24.13,10.64 | 24.13,10.64 25.4,10.64 | 22.86,10.64 SJ7.1 | 25.4,10.64 28.57,10.64 SJ10.1 | 25.4,10.64 SJ9.1 | 24.13,10.64 24.13,6.35 | 24.13,6.35 24.13,2.06 | IC1.13 49.21,8.57 49.21,19.84 48.9,20.16 48.9,27.3 IC2.1 | 24.13,6.35 27.3,6.35 v27.3,5.24
N$3
  Bottom 0.152: IC2.10 53.02,20.64 53.02,22.54 IC2.12 IC2.13
N$4
  Bottom 0.152: SV1.4 14.13,46.2 14.13,47.15 10.64,47.15 SJ11.2 10.48,47.15 10.16,46.83 10.16,27.15 11.43,25.88 | 16.19,25.88 19.05,25.88 19.05,25.4 U1.2 | 16.19,25.88 11.43,25.88 | W1.6 16.51,27.3 16.19,26.99 16.19,25.88 | 11.43,25.88 RGB.2
N$5  (via drill 0.35)
  Top 0.152: v33.66,6.99 33.02,7.62 28.42,7.62 | BUT10.10 28.42,7.62 | v47.31,11.59 47.31,8.26 35.4,8.26 33.97,9.68 33.97,11.27 33.5,11.75 32.54,11.75 28.42,7.62
  Bottom 0.152: BUT10.10 SJ9.2 | v33.66,6.99 IC1.11 | D10.A 45.4,20 45.4,16.03 46.51,14.92 48.58,14.92 48.58,12.86 v47.31,11.59
N$6
  Bottom 0.152: SV1.2 15.56,42.23 15.56,38.1 15.56,36.51 17.46,34.61 17.46,33.97 16.51,33.02 15.24,33.02 D1.C
N$7  (via drill 0.35)
  Top 0.152: v15.88,22.86 16.35,23.34 v25.24,23.34
  Bottom 0.152: W1.3 13.97,22.7 U1.5 13.97,22.86 v15.88,22.86 | W2.2 27.94,19.53 27.15,20.32 WS1.1 26.99,20.32 26.99,23.97 25.24,23.97 | 25.24,23.97 24.13,23.97 U2.6 | 25.24,23.97 v25.24,23.34
N$8
  Top 0.152: SV6.4 12.38,58.74 12.38,50.8 | 12.38,50.8 12.38,43.5 8.89,40.01 8.89,34.77 9.37,34.77 11.11,33.02 29.21,33.02 W2.5 | SV5.6 49.96,48.26 47.42,50.8 12.38,50.8
  Bottom 0.152: SV5.6 51.44,50.96 50.8,51.59 O5.2 | W2.5 30.48,28.1 30.64,27.94 30.64,24.13 29.21,24.13 U2.3
N$9
  Bottom 0.152: SV2.2 20.64,40.01 20.64,38.1 20.64,28.89 D2.C
N$10  (via drill 0.35)
  Top 0.152: D3.C v32.7,32.07
  Bottom 0.152: SV3.2 32.7,42.86 32.7,36.83 v32.7,32.07
N$11  (via drill 0.35)
  Top 0.152: v44.13,13.81 43.5,14.45 v23.18,14.45
  Bottom 0.152: BUT10.2 SJ1.2 15.24,9.84 14.29,9.84 14.29,10.95 15.08,11.75 20.32,11.75 20.32,17.3 | IC1.2 46.67,10.16 46.67,11.27 v44.13,13.81 | 20.32,17.3 v23.18,14.45 | D2.A 20.32,17.3
N$12  (via drill 0.35)
  Top 0.152: D3.A 30.48,22.23 v40.32,22.23
  Bottom 0.152: BUT10.3 17.78,3.49 | 17.78,3.49 SJ2.2 | 41.91,11.43 41.59,11.75 36.83,11.75 36.83,9.37 35.08,7.62 27.94,7.62 27.94,2.86 26.51,1.43 16.83,1.43 16.83,2.54 17.78,3.49 | 41.91,11.43 IC1.4 | v40.32,22.23 40.64,21.91 40.64,20 41.91,18.73 41.91,11.43
N$13  (via drill 0.35)
  Top 0.152: v19.05,9.84 20.64,11.43 28.57,11.43 29.21,12.06 33.66,12.06 IC1.7
  Bottom 0.152: BUT10.4 SJ3.2 17.78,9.84 v19.05,9.84 | IC1.7 36.51,11.11 36.51,15.72 36.83,16.03 36.83,18.41 D4.A
N$14  (via drill 0.35)
  Top 0.152: D5.A 39.53,18.57 24.39,18.57 22.96,20 21.7,20 21.16,19.46 18.66,19.46 17.78,18.57 v13.34,18.57
  Bottom 0.152: SJ4.2 BUT10.5 20.32,6.35 17.3,6.35 16.51,5.56 16.51,1.59 | IC1.10 33.97,4.13 28.26,4.13 28.26,2.7 26.67,1.11 16.51,1.11 16.51,1.59 | v13.34,18.57 12.7,17.94 12.7,5.4 16.51,1.59
N$15  (via drill 0.35)
  Top 0.152: IC1.1 48.74,12.22 38.89,12.22 38.42,11.75 37.62,11.75 36.67,12.7 20.48,12.7 19.05,11.27 | 19.05,11.27 18.1,10.32 18.1,8.89 19.05,8.89 BUT10.6 | v17.78,12.38 18.89,11.27 19.05,11.27
  Bottom 0.152: BUT10.6 SJ5.2 | v17.78,12.38 D6.A
N$16  (via drill 0.35)
  Top 0.152: IC1.5 39.05,8.57 37.62,8.57 36.51,9.68 36.51,12.38 24.13,12.38 | 24.13,12.38 20.64,12.38 18.41,10.16 18.41,9.21 20.48,9.21 21.59,8.1 21.59,5.08 BUT10.7 | 24.13,12.38 v24.13,12.06
  Bottom 0.152: BUT10.7 SJ6.2 | v24.13,12.06 D7.A
N$17  (via drill 0.35)
  Top 0.152: v36.04,5.56 35.72,5.87 26.35,5.87 25.88,6.35 24.13,6.35 23.18,7.3 | v29.53,11.43 26.99,8.89 24.77,8.89 23.18,7.3 | 23.18,7.3 BUT10.8
  Bottom 0.152: BUT10.8 SJ7.2 | IC1.6 36.04,8.1 v36.04,5.56 | D8.A 30.32,22.38 30.32,23.02 30,23.34 27.94,23.34 27.94,20 29.21,18.73 29.21,11.75 v29.53,11.43
N$18  (via drill 0.35)
  Top 0.152: IC1.9 v26.67,2.54 15.56,2.54 8.73,9.37 2.54,9.37 2.54,18.1 3.49,19.05 6.67,19.05 6.83,19.21 17.78,19.21 18.33,19.76 21.03,19.76 21.59,20.32 23.08,20.32 24.19,19.21 35.08,19.21 D9.A
  Bottom 0.152: BUT10.9 25.4,3.81 | 25.4,3.81 SJ8.2 | 25.4,3.81 v26.67,2.54
N$19  (via drill 0.35)
  Top 0.152: v41.91,30.8 40.96,29.84 35.56,29.84 D4.C
  Bottom 0.152: SV4.2 41.91,42.86 41.91,36.83 v41.91,30.8
N$20  (via drill 0.35)
  Top 0.152: v50.64,33.34 47.47,30.16 43.5,30.16 D5.C
  Bottom 0.152: SV5.2 50.64,42.39 50.64,38.1 v50.64,33.34
N$21
  Bottom 0.406: LED1.A R1.1
N$22  (via drill 0.35)
  Top 0.152: v26.35,21.59 28.26,23.5 v36.35,23.5
  Bottom 0.152: 26.19,20.32 25.4,19.53 W2.3 | 25.88,20.95 26.19,20.64 26.19,20.32 | 25.88,20.95 24.13,22.7 U2.5 | 26.19,20.32 WS1.2 | W3.2 40.64,19.53 39.85,20.32 WS2.2 39.69,20.32 39.69,23.97 37.78,23.97 U3.6 37.62,23.97 37.62,23.5 v36.35,23.5 | 25.88,20.95 26.35,21.43 v26.35,21.59
N$23
  Bottom 0.152: SV6.2 16.19,56.83 16.19,48.9 15.88,48.58 15.88,38.1 15.88,36.67 17.78,34.77 D6.C
N$24
  Top 0.152: TB1.2 71.75,67.63 74.45,67.63 S1.2
  Bottom 0.152: S1.1 74.61,61.28 74.61,67.63 S1.2
N$25  (via drill 0.35)
  Top 0.152: SV8.2 32.38,59.05 v29.69,59.05
  Bottom 0.152: v29.69,59.05 30,58.74 30,36.83 30,36.35 31.59,34.77 31.59,33.66 31.43,33.5 31.43,32.54 31.75,32.23 D8.C
N$26  (via drill 0.35)
  Top 0.152: SV9.2 41.59,59.05 v40.32,59.05
  Bottom 0.152: v40.32,59.05 37.15,55.88 37.15,36.83 37.15,34.92 36.99,34.77 36.99,32.38 36.83,32.23 D9.C
N$27  (via drill 0.35)
  Top 0.152: v52.86,52.55 57.31,48.1 57.31,39.37 57.31,28.26 44.77,28.26 D10.C
  Bottom 0.152: SV10.2 52.86,56.99 v52.86,52.55
N$28
  Top 0.152: TB1.1 73.03,60.01 77.95,60.01 79.06,61.12 S1.3
  Bottom 0.152: S1.4 79.22,67.63 79.22,61.28 S1.3
N$29
  Top 0.152: TLED1.A TB1.3
N$30
  Top 0.152: TLED1.K TB1.4
N$31
  Top 0.152: TB2.2 71.75,58.42 74.45,58.42 S2.2
  Bottom 0.152: S2.1 74.61,52.07 74.61,58.42 S2.2
N$32
  Top 0.152: TB2.1 73.03,50.8 77.95,50.8 79.06,51.91 S2.3
  Bottom 0.152: S2.4 79.22,58.42 79.22,52.07 S2.3
N$33
  Top 0.152: TLED2.A TB2.3
N$34
  Top 0.152: TLED2.K TB2.4
N$35  (via drill 0.35)
  Top 0.152: v38.89,4.13 38.58,4.45 26.51,4.45 25.88,3.81 22.23,3.81 21.91,4.13 21.11,4.13 20.8,3.81 16.51,3.81 BUT10.1
  Bottom 0.152: IC1.3 44.61,9.05 44.61,5.87 42.86,4.13 v38.89,4.13 | D1.A 15.24,12.38 13.97,11.11 13.97,6.35 BUT10.1
N$36
  Top 0.152: TB3.2 71.75,49.21 74.45,49.21 S3.2
  Bottom 0.152: S3.1 74.61,42.86 74.61,49.21 S3.2
N$37
  Top 0.152: TB3.1 73.03,41.59 77.95,41.59 79.06,42.7 S3.3
  Bottom 0.152: S3.4 79.22,49.21 79.22,42.86 S3.3
N$38
  Top 0.152: TLED3.A TB3.3
N$39
  Top 0.152: TLED3.K TB3.4
N$40
  Top 0.152: TB4.2 71.75,40.01 74.45,40.01 S4.2
  Bottom 0.152: S4.1 74.61,33.66 74.61,40.01 S4.2
N$41
  Top 0.152: TB4.1 73.03,32.38 77.95,32.38 79.06,33.5 S4.3
  Bottom 0.152: S4.4 79.22,40.01 79.22,33.66 S4.3
N$42
  Top 0.152: TLED4.A TB4.3
N$43
  Top 0.152: TLED4.K TB4.4
N$44
  Top 0.152: TB5.2 71.75,30.8 74.45,30.8 S5.2
  Bottom 0.152: S5.1 74.61,24.45 74.61,30.8 S5.2
N$45  (via drill 0.35)
  Top 0.152: v16.83,26.67 16.19,27.3 14.76,27.3 11.43,30.64 W1.8 | SV2.4 22.54,44.45 16.83,44.45 | 16.83,44.45 15.88,45.4 15.88,48.26 SV1.6 | v12.86,43.02 14.29,44.45 16.83,44.45
  Bottom 0.152: v16.83,26.67 19.05,26.67 U1.1 | SV1.6 14.61,50.96 15.24,51.59 O1.2 | W1.8 12.38,32.7 12.38,33.66 12.86,34.13 12.86,38.1 v12.86,43.02
N$46  (via drill 0.35)
  Top 0.152: v30.96,46.35 30.64,46.67 26.99,46.67 26.67,46.99 25.08,46.99 SV2.6
  Bottom 0.152: U1.3 19.21,24.13 20.16,24.13 20.16,26.99 19.05,28.1 W1.5 20.32,33.02 20.32,38.1 20.32,44.77 SV2.6 23.81,51.28 24.13,51.59 O2.2 | SV3.4 30.96,45.72 v30.96,46.35
N$47
  Top 0.152: TB5.1 71.12,25.08 73.5,25.08 74.14,25.72 77.79,25.72 79.06,24.45 S5.3
  Bottom 0.152: S5.4 79.22,30.8 79.22,24.45 S5.3
N$48
  Top 0.152: TLED5.A TB5.3
N$49  (via drill 0.35)
  Top 0.152: W2.8 27.3,27.3 38.89,27.3 41.75,30.16 43.02,30.16 43.34,30.48 43.66,30.48 v46.04,32.86
  Bottom 0.152: W2.8 22.86,24.61 30,24.61 30.32,24.92 30.32,26.51 29.21,26.51 U2.1 | 42.23,49.53 SV4.6 42.23,46.99 45.09,46.99 46.04,46.04 46.04,38.1 v46.04,32.86 | 42.23,49.53 42.23,51.28 41.91,51.59 O4.2 | SV5.4 47.62,49.53 42.23,49.53
N$50
  Top 0.152: TLED5.K TB5.4
N$51  (via drill 0.35)
  Top 0.152: v40.96,46.99 34.29,46.99 33.34,47.94 | v29.37,47.31 30,47.94 33.34,47.94 | 33.34,47.94 SV3.6
  Bottom 0.152: U2.2 29.05,25.4 27.94,25.4 W2.6 29.37,33.18 29.37,36.83 v29.37,47.31 | SV3.6 O3.2 | v40.96,46.99 SV4.4
N$52
  Top 0.152: TB6.2 87,67.63 89.69,67.63 S6.2
  Bottom 0.152: S6.1 89.85,61.28 89.85,67.63 S6.2
N$53
  Top 0.152: TB6.1 88.27,60.01 93.19,60.01 94.3,61.12 S6.3
  Bottom 0.152: S6.4 94.46,67.63 94.46,61.28 S6.3
N$54  (via drill 0.35)
  Top 0.152: W3.6 39.21,33.18 v32.07,33.18
  Bottom 0.152: W3.6 40.64,25.4 42.86,25.4 U3.2 | 15.24,65.56 14.61,64.93 SV6.6 | 15.24,65.56 19.21,65.56 SV7.4 23.81,59.69 30,59.69 30.32,59.37 30.32,44.29 31.91,42.7 31.91,36.83 31.91,33.34 v32.07,33.18 | 15.24,65.56 O6.2
N$55
  Top 0.152: TLED6.A TB6.3
N$56
  Top 0.152: SV8.4 31.75,59.69 16.83,59.69 15.88,60.64 15.88,62.23 22.54,62.23 SV7.6
  Bottom 0.152: U3.1 43.02,26.51 44.13,26.51 44.13,24.92 43.81,24.61 35.56,24.61 W3.8 36.67,32.86 36.67,36.83 36.67,42.07 36.83,42.23 36.83,54.93 34.29,57.47 34.29,59.69 SV8.4 | SV7.6 23.81,65.25 24.13,65.56 O7.2
N$57
  Bottom 0.152: U3.3 43.02,24.13 44.45,24.13 44.45,26.83 43.18,28.1 W3.5 44.13,32.7 44.13,41.59 43.5,42.23 43.5,43.5 42.55,44.45 40.96,44.45 39.69,45.72 39.69,57.47 42.23,60.01 SV9.4 38.26,64.93 33.02,64.93 | SV8.6 33.02,64.93 | 33.02,64.93 O8.2
N$58  (via drill 0.35)
  Top 0.152: 52.7,59.69 55.24,59.69 59.37,55.56 R2.2 | SV10.4 52.7,59.69 | v43.5,60.17 43.97,59.69 52.7,59.69
  Bottom 0.152: O9.2 41.91,65.56 42.23,65.25 SV9.6 43.5,62.23 v43.5,60.17 | SV10.4 52.7,62.23 52.7,67.15 14.61,67.15 13.02,65.56 13.02,48.1 10.64,48.1 SJ11.1
N$59
  Top 0.152: TLED6.K TB6.4
N$60
  Top 0.152: TB7.2 87,58.42 89.69,58.42 S7.2
  Bottom 0.152: S7.1 89.85,52.07 89.85,58.42 S7.2
N$61
  Top 0.152: TB7.1 88.27,50.8 93.19,50.8 94.3,51.91 S7.3
  Bottom 0.152: S7.4 94.46,58.42 94.46,52.07 S7.3
N$62
  Top 0.152: TLED7.A TB7.3
N$63
  Top 0.152: TLED7.K TB7.4
N$64
  Top 0.152: TB8.2 87,49.21 89.69,49.21 S8.2
  Bottom 0.152: S8.1 89.85,42.86 89.85,49.21 S8.2
N$65
  Top 0.152: TB8.1 88.27,41.59 93.19,41.59 94.3,42.7 S8.3
  Bottom 0.152: S8.4 94.46,49.21 94.46,42.86 S8.3
N$66
  Top 0.152: TLED8.A TB8.3
N$67
  Top 0.152: TLED8.K TB8.4
N$68
  Top 0.152: TB9.2 87,40.01 89.69,40.01 S9.2
  Bottom 0.152: S9.1 89.85,33.66 89.85,40.01 S9.2
N$69
  Top 0.152: TB9.1 88.27,32.38 93.19,32.38 94.3,33.5 S9.3
  Bottom 0.152: S9.4 94.46,40.01 94.46,33.66 S9.3
N$70
  Top 0.152: TLED9.A TB9.3
N$71
  Top 0.152: TLED9.K TB9.4
N$72
  Top 0.152: TB10.2 87,30.8 89.69,30.8 S10.2
  Bottom 0.152: S10.1 89.85,24.45 89.85,30.8 S10.2
N$73
  Top 0.152: TB10.1 86.36,25.08 88.74,25.08 89.38,25.72 93.03,25.72 94.3,24.45 S10.3
  Bottom 0.152: S10.4 94.46,30.8 94.46,24.45 S10.3
N$74
  Top 0.152: TLED10.A TB10.3
N$75
  Top 0.152: TLED10.K TB10.4
N$76
  Bottom 0.152: U1.8 13.91,30.12 12.78,31.26 12.78,33.1 C4.1 R3.1
N$77
  Bottom 0.152: U2.8 26.67,29.23 26.67,34.29 | 26.67,34.29 R4.1 | 26.67,34.29 C5.1
N$78
  Bottom 0.152: U3.8 39.37,28.14 39.37,34.29 | 39.37,34.29 C6.1 | R5.1 39.37,34.29
N$79  (via drill 0.35)
  Top 0.152: OUTP.1 59.69,12.7 38.42,12.7 v38.1,12.38
  Bottom 0.152: OUTP.1 62.23,12.22 61.44,11.43 END.2 | 38.89,20.32 38.1,19.53 W3.3 v38.1,12.38 | 38.89,20.32 38.89,21.59 37.78,22.7 U3.5 37.62,22.86 33.02,22.86 33.02,31.43 34.29,32.7 34.29,36.83 34.29,51.75 33.66,52.39 33.02,52.39 O3.1 33.02,52.55 31.75,53.82 31.75,65.72 32.38,66.36 | 38.89,20.32 WS2.1 | 50.16,52.55 50.8,52.55 O5.1 | 50.16,52.55 41.91,52.55 O4.1 | 50.16,62.23 SV10.6 | 50.16,52.55 50.16,62.23 | 13.34,59.69 13.34,65.09 14.61,66.36 15.24,66.36 O6.1 15.24,66.52 24.13,66.52 O7.1 24.13,66.36 32.38,66.36 | 13.34,59.69 13.34,54.45 15.24,52.55 O1.1 | 13.34,59.69 18.1,59.69 18.41,59.37 18.41,58.26 24.13,52.55 O2.1 | 32.38,66.36 33.02,66.36 O8.1 33.02,66.52 41.91,66.52 O9.1 41.91,66.36 46.04,66.36 50.16,62.23
O6
  Bottom 0.152: SV7.2 25.08,57.15 25.08,36.83 25.08,35.24 24.45,34.61 24.45,32.54 24.13,32.23 D7.C
RESERVE
  Top 0.152: INP.8 5.08,24.13 44.93,24.13 46.04,23.02 59.53,23.02 OUTP.8
  Bottom 0.152: OUTP.8 59.69,25.88 60.01,26.19 END1.2
RESET
  Top 0.152: IC2.8 IC2.9 63.5,16.51 63.5,23.18 59.05,27.62 45.88,27.62 44.29,26.04 2.22,26.04 2.22,21.91 INP.6
  Bottom 0.152: IC1.15 50.32,4.6 50.32,6.67 54.61,10.95 IC2.8
RESET_OUT
  Top 0.152: IC2.11 55.56,20.64 59.37,20.64 OUTP.6
RETURN
  Top 0.152: INP.2 6.03,13.02 57.47,13.02 OUTP.2
  Bottom 0.152: OUTP.2 59.69,12.22 60.48,11.43 END.1

### Text on the board
Top: Top Layer
Bottom: BOTTOM Layer
tPlace: + | + | + | + | + | + | Push Button / Action 4017 | 01.08.20 / V 1.2 | Kai & Hardi | + | + | + | + | 01.08.20 V 1.2 | Kai & Hardi | + | Read keyboard matrix
bPlace: Kai & Hardi | Push Button / Action 4017 | Push Button Action 4017 (300) | Kai & Hardi
tNames: Cut here if used to read a keyboard matrix